# Altium schematic sheet sixuanyi.SchDoc
size A2
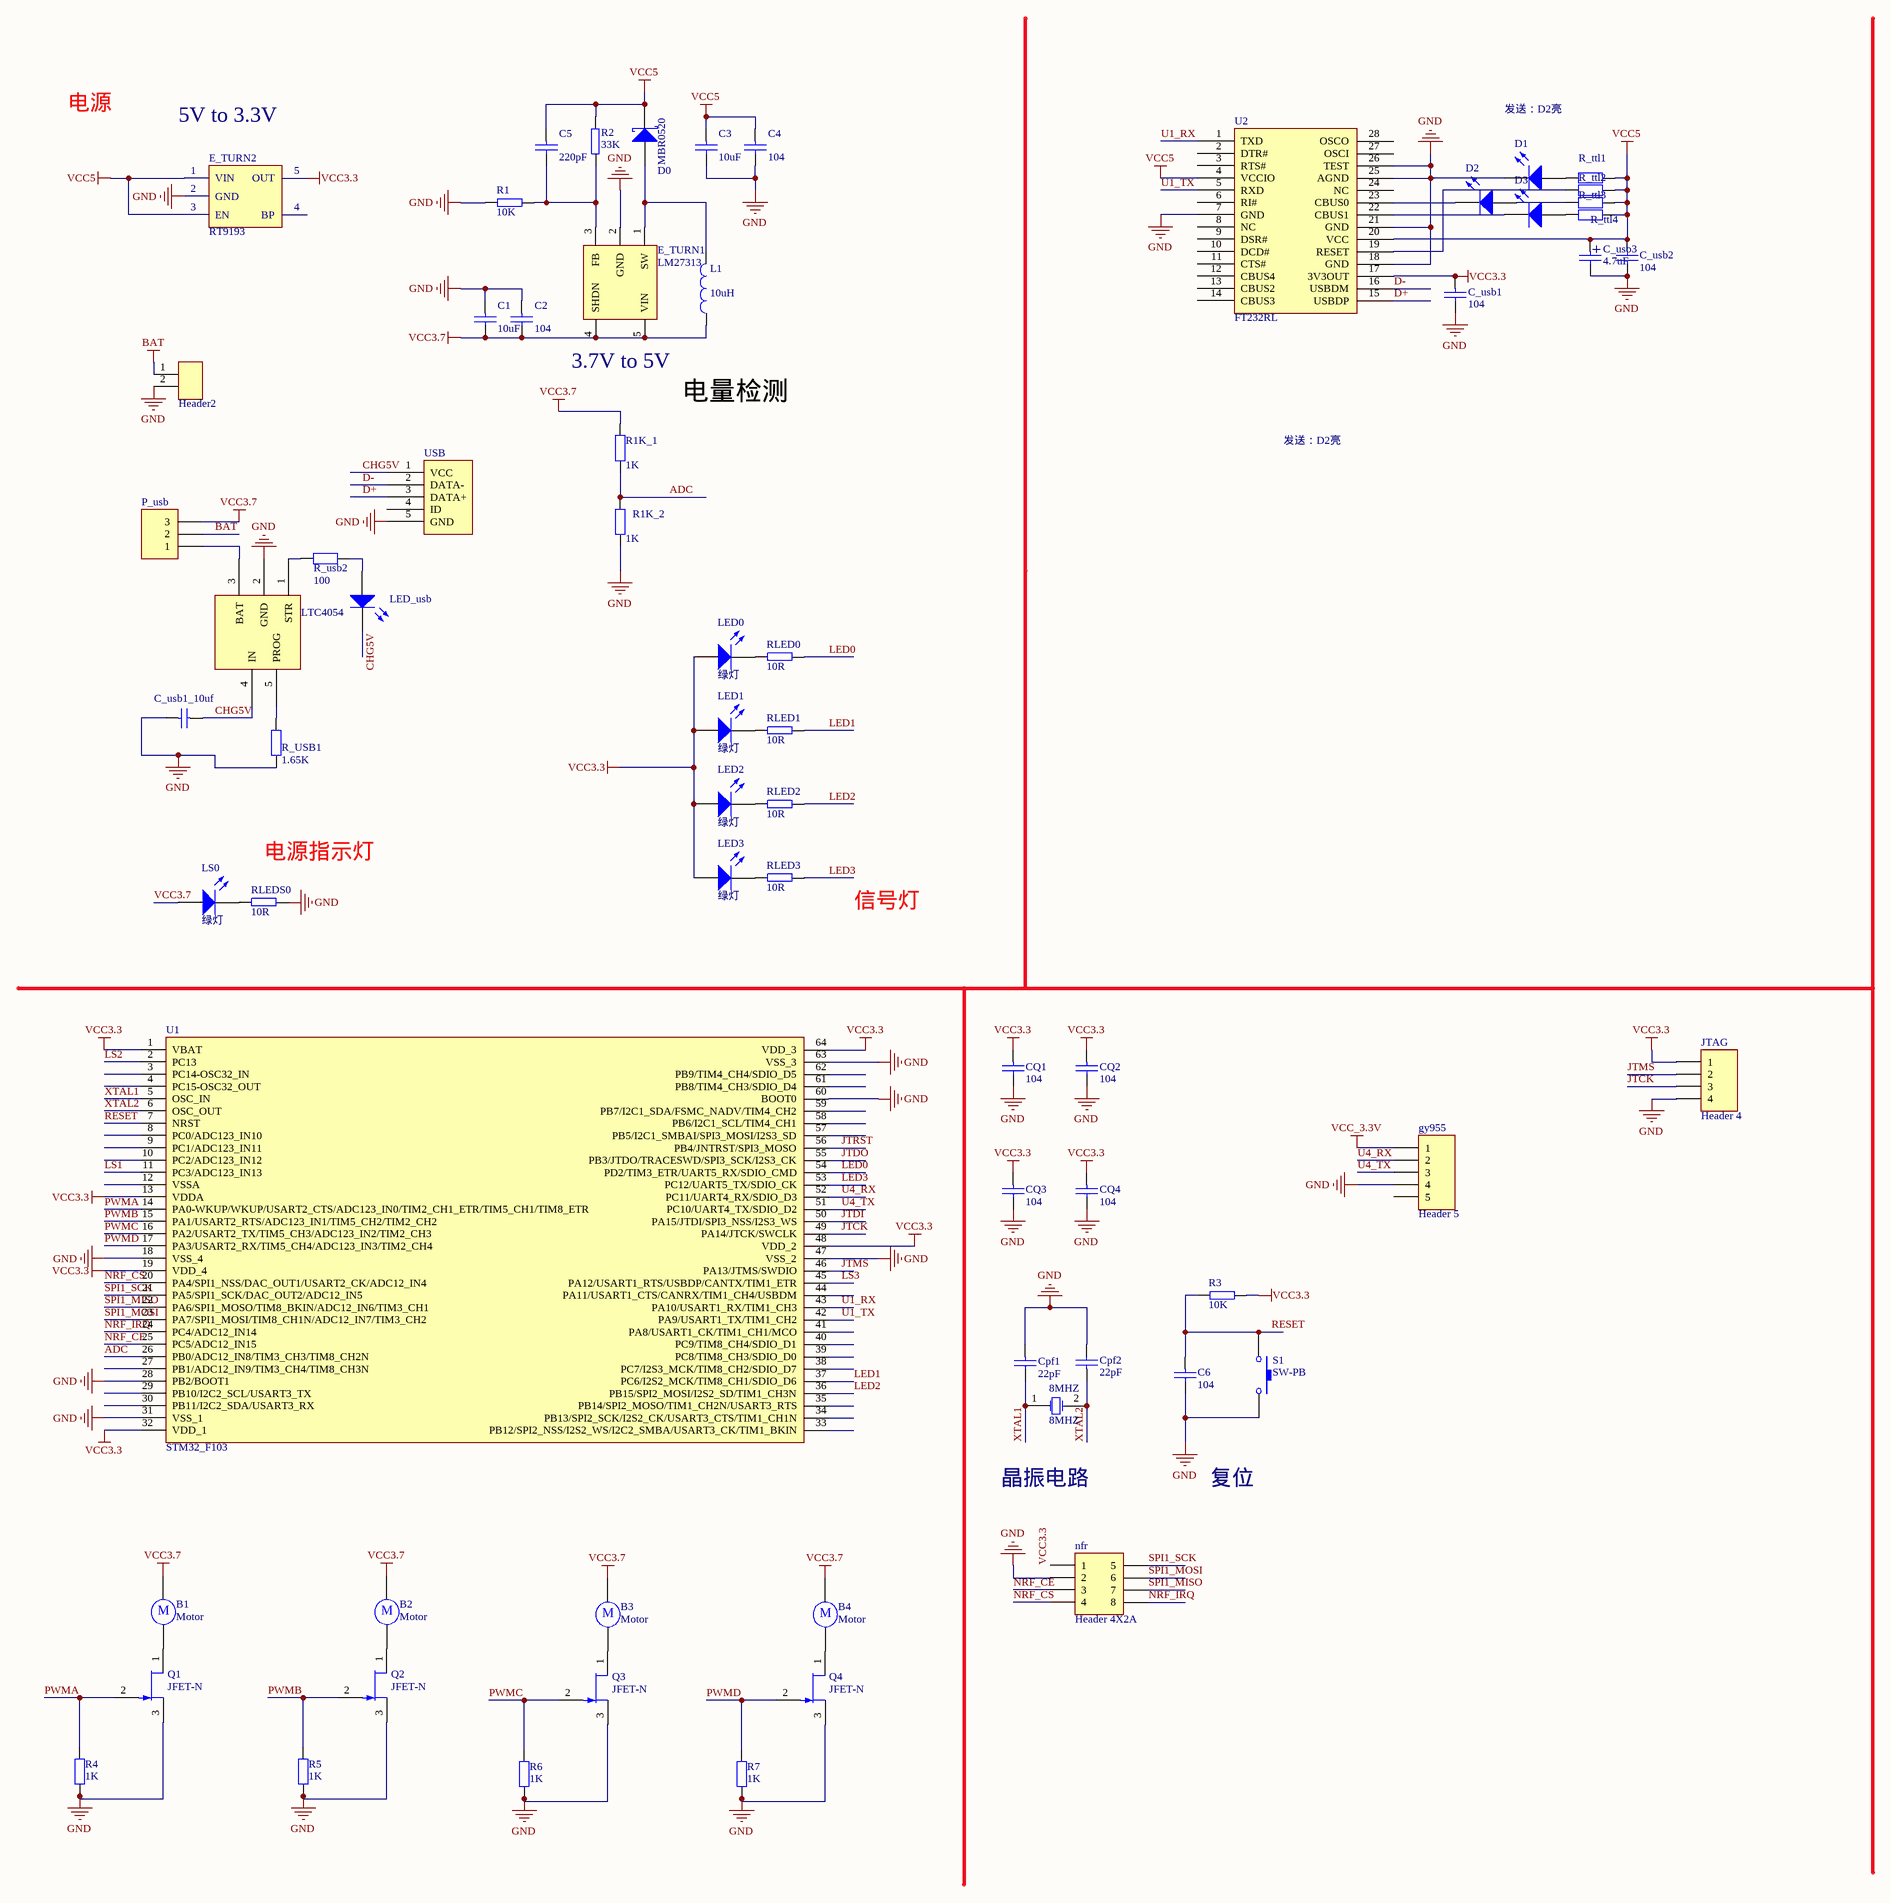
[diagram p0: sixuanyi.SchDoc]

## Parts
8MHZ  8MHZ  [XTAL_D]
B1  Motor  [RB5-10.5]
B2  Motor  [RB5-10.5]
B3  Motor  [RB5-10.5]
B4  Motor  [RB5-10.5]
C1  10uF  [0603p]
C2  104  [0603p]
C3  10uF  [0603_WYN]
C4  104  [0603_WYN]
C5  220pF  [0603_WYN]
C6  104  [0603_WYN]
C_usb1  104  [0603P]
C_usb1_10uf  C_usb1_10uf  [0603p]  (value not drawn)
C_usb2  104  [0603P]
C_usb3  4.7uF  [1206]
Cpf1  22pF  [0603_WYN]
Cpf2  22pF  [0603_WYN]
CQ1  104  [0603_WYN]
CQ2  104  [0603_WYN]
CQ3  104  [0603_WYN]
CQ4  104  [0603_WYN]
D0  MBR0520  [SMB]
D1  LED2  [SMDLED]  (value not drawn)
D2  LED2  [SMDLED]  (value not drawn)
D3  LED2  [SMDLED]  (value not drawn)
E_TURN1  LM27313  [SOT23-6]
E_TURN2  RT9193  [SOT23-6]
gy955  Header 5  [HDR1X5]
JTAG  Header 4  [HDR1X4]
L1  value 10uH  [0805_WYN]  (hidden comment: Inductor)
LED0  绿灯  [0603_WYN]
LED1  绿灯  [0603_WYN]
LED2  绿灯  [0603_WYN]
LED3  绿灯  [0603_WYN]
LED_usb  黄灯  [极性0805_WYN]  (value not drawn)
LS0  绿灯  [0603_WYN]
LTC4054  LTC4054  [SOT23-6]
nfr  Header 4X2A  [24L01-L]
P_usb  P_usb  [HDR1X3]  (value not drawn)
power  Header2  [HDR1X2]
Q1  JFET-N  [SI2302]
Q2  JFET-N  [SI2302]
Q3  JFET-N  [SI2302]
Q4  JFET-N  [SI2302]
R1  10K  [0603_WYN]
R1K_1  value 1K  [AXIAL-0.4]  (hidden comment: Res2)
R1K_2  value 1K  [AXIAL-0.4]  (hidden comment: Res2)
R2  33K  [0603_WYN]
R3  10K  [0603_WYN]
R4  value 1K  [AXIAL-0.4]  (hidden comment: Res2)
R5  value 1K  [AXIAL-0.4]  (hidden comment: Res2)
R6  value 1K  [AXIAL-0.4]  (hidden comment: Res2)
R7  value 1K  [AXIAL-0.4]  (hidden comment: Res2)
R_ttl1  1K  [0603p]  (value not drawn)
R_ttl2  1K  [0603p]  (value not drawn)
R_ttl3  1K  [0603p]  (value not drawn)
R_ttl4  1K  [0603p]  (value not drawn)
R_USB1  R_USB1  value 1.65K  [0603p]
R_usb2  R_usb2  value 100  [0603p]
RLED0  10R  [0603_WYN]
RLED1  10R  [0603_WYN]
RLED2  10R  [0603_WYN]
RLED3  10R  [0603_WYN]
RLEDS0  10R  [0603_WYN]
S1  SW-PB  [CLICK]
U1  STM32_F103  [LQFP64]
U2  FT232RL  [SSOP-28]
USB  usb mini  [USB - duplicate1]  (value not drawn)

## Nets
BAT: P_usb.2 power.1
GND: C1.1 C2.1 C3.2 C4.2 C6.2 C_usb1.2 C_usb1_10uf.2 C_usb2.2 C_usb3.2 Cpf1.1 Cpf2.2 CQ1.2 CQ2.2 CQ3.2 CQ4.2 D1.2(K) E_TURN1.2(GND) E_TURN2.2(GND) gy955.4 JTAG.4 LTC4054.2(GND) nfr.2 power.2 Q1.3(S) Q2.3(S) Q3.3(S) Q4.3(S) R1.1 R1K_2.1 R4.1 R5.1 R6.1 R7.1 R_USB1.1 RLEDS0.1 S1.2 U1.18(VSS_4) U1.28(PB2/BOOT1) U1.31(VSS_1) U1.47(VSS_2) U1.60(BOOT0) U1.63(VSS_3) U2.7(GND) U2.18(GND) U2.21(GND) U2.25(AGND) U2.26(TEST) USB.5(GND)
VCC3.3: C_usb1.1 CQ1.1 CQ2.1 CQ3.1 CQ4.1 E_TURN2.5(OUT) JTAG.1 LED0.1(A) LED1.1(A) LED2.1(A) LED3.1(A) nfr.1 R3.2 U1.1(VBAT) U1.13(VDDA) U1.19(VDD_4) U1.32(VDD_1) U1.48(VDD_2) U1.64(VDD_3) U2.17(3V3OUT)
VCC3.7: B1.1 B2.1 B3.1 B4.1 C1.2 C2.2 E_TURN1.4(SHDN) E_TURN1.5(VIN) L1.1 LS0.1(A) P_usb.3 R1K_1.2
VCC5: C3.1 C4.1 C5.1 C_usb2.1 C_usb3.1 D0.2(K) E_TURN2.1(VIN) E_TURN2.3(EN) R2.2 R_ttl1.2 R_ttl2.2 R_ttl3.2 R_ttl4.2 U2.4(VCCIO) U2.20(VCC)
VCC_3.3V: gy955.1
ADC: R1K_1.1 R1K_2.2 U1.26(PB0/ADC12_IN8/TIM3_CH3/TIM8_CH2N)
CHG5V: C_usb1_10uf.1 LED_usb.2(K) LTC4054.4(IN) USB.1(VCC)
D+: U2.15(USBDP) USB.3(DATA+)
D-: U2.16(USBDM) USB.2(DATA-)
JTCK: JTAG.3 U1.49(PA14/JTCK/SWCLK)
JTDI: U1.50(PA15/JTDI/SPI3_NSS/I2S3_WS)
JTDO: U1.55(PB3/JTDO/TRACESWD/SPI3_SCK/I2S3_CK)
JTMS: JTAG.2 U1.46(PA13/JTMS/SWDIO)
JTRST: U1.56(PB4/JNTRST/SPI3_MOSO)
LED0: RLED0.1 U1.54(PD2/TIM3_ETR/UART5_RX/SDIO_CMD)
LED1: RLED1.1 U1.37(PC6/I2S2_MCK/TIM8_CH1/SDIO_D6)
LED2: RLED2.1 U1.36(PB15/SPI2_MOSI/I2S2_SD/TIM1_CH3N)
LED3: RLED3.1 U1.53(PC12/UART5_TX/SDIO_CK)
LS1: U1.11(PC3/ADC123_IN13)
LS2: U1.2(PC13)
LS3: U1.45(PA12/USART1_RTS/USBDP/CANTX/TIM1_ETR)
NRF_CE: nfr.3 U1.25(PC5/ADC12_IN15)
NRF_CS: nfr.4 U1.20(PA4/SPI1_NSS/DAC_OUT1/USART2_CK/ADC12_IN4)
NRF_IRQ: nfr.8 U1.24(PC4/ADC12_IN14)
PWMA: Q1.2(G) R4.2 U1.14(PA0-WKUP/WKUP/USART2_CTS/ADC123_IN0/TIM2_CH1_ETR/TIM5_CH1/TIM8_ETR)
PWMB: Q2.2(G) R5.2 U1.15(PA1/USART2_RTS/ADC123_IN1/TIM5_CH2/TIM2_CH2)
PWMC: Q3.2(G) R6.2 U1.16(PA2/USART2_TX/TIM5_CH3/ADC123_IN2/TIM2_CH3)
PWMD: Q4.2(G) R7.2 U1.17(PA3/USART2_RX/TIM5_CH4/ADC123_IN3/TIM2_CH4)
RESET: C6.1 R3.1 S1.1 U1.7(NRST)
SPI1_MISO: nfr.7 U1.22(PA6/SPI1_MOSO/TIM8_BKIN/ADC12_IN6/TIM3_CH1)
SPI1_MOSI: nfr.6 U1.23(PA7/SPI1_MOSI/TIM8_CH1N/ADC12_IN7/TIM3_CH2)
SPI1_SCK: nfr.5 U1.21(PA5/SPI1_SCK/DAC_OUT2/ADC12_IN5)
U1_RX: U1.43(PA10/USART1_RX/TIM1_CH3) U2.1(TXD)
U1_TX: U1.42(PA9/USART1_TX/TIM1_CH2) U2.5(RXD)
U4_RX: gy955.2 U1.52(PC11/UART4_RX/SDIO_D3)
U4_TX: gy955.3 U1.51(PC10/UART4_TX/SDIO_D2)
XTAL1: 8MHZ.1(OSC1) Cpf1.2 U1.5(OSC_IN)
XTAL2: 8MHZ.2(OSC2) Cpf2.1 U1.6(OSC_OUT)
NetB1_2: B1.2 Q1.1(D)
NetB2_2: B2.2 Q2.1(D)
NetB3_2: B3.2 Q3.1(D)
NetB4_2: B4.2 Q4.1(D)
NetC5_2: C5.2 E_TURN1.3(FB) R1.2 R2.1
NetD0_1: D0.1(A) E_TURN1.1(SW) L1.2
NetD1_1: D1.1(A) R_ttl1.1
NetD2_1: D2.1(A) R_ttl3.1
NetD2_2: D2.2(K) U2.23(CBUS0)
NetD3_1: D3.1(A) R_ttl4.1
NetD3_2: D3.2(K) U2.22(CBUS1)
NetLED0_2: LED0.2(K) RLED0.2
NetLED1_2: LED1.2(K) RLED1.2
NetLED2_2: LED2.2(K) RLED2.2
NetLED3_2: LED3.2(K) RLED3.2
NetLED_usb_1: LED_usb.1(A) R_usb2.2
NetLS0_2: LS0.2(K) RLEDS0.2
NetLTC4054_1: LTC4054.1(STR) R_usb2.1
NetLTC4054_3: LTC4054.3(BAT) P_usb.1
NetLTC4054_5: LTC4054.5(PROG) R_USB1.2
NetR_ttl2_1: R_ttl2.1 U2.19(RESET)

Not connected (* = marked no-connect by the designer): E_TURN2 4(BP); gy955 5; U1 3(PC14-OSC32_IN) 4(PC15-OSC32_OUT) 8(PC0/ADC123_IN10) 9(PC1/ADC123_IN11) 10(PC2/ADC123_IN12) 12(VSSA) 27(PB1/ADC12_IN9/TIM3_CH4/TIM8_CH3N) 29(PB10/I2C2_SCL/USART3_TX) 30(PB11/I2C2_SDA/USART3_RX) 33(PB12/SPI2_NSS/I2S2_WS/I2C2_SMBA/USART3_CK/TIM1_BKIN) 34(PB13/SPI2_SCK/I2S2_CK/USART3_CTS/TIM1_CH1N) 35(PB14/SPI2_MOSO/TIM1_CH2N/USART3_RTS) 38(PC7/I2S3_MCK/TIM8_CH2/SDIO_D7) 39(PC8/TIM8_CH3/SDIO_D0) 40(PC9/TIM8_CH4/SDIO_D1) 41(PA8/USART1_CK/TIM1_CH1/MCO) 44(PA11/USART1_CTS/CANRX/TIM1_CH4/USBDM) 57(PB5/I2C1_SMBAI/SPI3_MOSI/I2S3_SD) 58(PB6/I2C1_SCL/TIM4_CH1) 59(PB7/I2C1_SDA/FSMC_NADV/TIM4_CH2) 61(PB8/TIM4_CH3/SDIO_D4) 62(PB9/TIM4_CH4/SDIO_D5); U2 2(DTR#) 3(RTS#) 6(RI#) 8(NC) 9(DSR#) 10(DCD#) 11(CTS#) 12(CBUS4) 13(CBUS2) 14(CBUS3) 24(NC) 27(OSCI) 28(OSCO); USB 4(ID)

## Notes on the sheet
- 电源
- 5V to 3.3V
- 发送：D2亮
- 3.7V to 5V
- 电量检测
- (near RLEDS0) 电源指示灯
- 信号灯
- 晶振电路
- 复位
- (in symbol Motor) M

## Library data of the parts
8MHZ = XTAL: Crystal Oscillator; Published: 8-Jun-2000; LatestRevisionDate: 17-Jul-2002; LatestRevisionNote: Re-released for DXP Platform.; Publisher: Altium Limited
B1-B4 = Motor: Motor, General Kind; Published: 24-Mar-1999; LatestRevisionDate: 17-Jul-2002; LatestRevisionNote: Re-released for DXP Platform.; PackageReference: RB5-10.5; Publisher: Altium Limited; PackageDescription: Capacitor (Radial); 2 Leads
C1-C6 C_usb1 C_usb2 Cpf1 Cpf2 CQ1-CQ4 = CAP_WYN
C_usb1_10uf = Cap: Capacitor; Value: 0.1uF; Published: 8-Jun-2000; LatestRevisionDate: 17-Jul-2002; LatestRevisionNote: Re-released for DXP Platform.; PackageReference: RAD-0.3; Publisher: Altium Limited; PackageDescription: Radial Cap, Thru-Hole; 2 Leads; 0.3 in Pin Spacing
C_usb3 = CAP_POL_WYN
D0 = D Schottky: Schottky Diode; Published: 8-Jun-2000; LatestRevisionDate: 17-Jul-2002; LatestRevisionNote: Re-released for DXP Platform.; PackageReference: SMB; Publisher: Altium Limited; PackageDescription: DO-214-AA/SMB; 2 C-Bend Leads; Body 5.3 x 3.6 mm, inc. leads (LxW); Code_JEDEC: DO-214-AA
D1-D3 = LED2: Typical RED, GREEN, YELLOW, AMBER GaAs LED; Published: 8-Jun-2000; LatestRevisionDate: 17-Jul-2002; LatestRevisionNote: Re-released for DXP Platform.; PackageVersion: Feb-2002; PackageReference: 3.2X1.6X1.1; Publisher: Altium Limited; PackageDescription: SM LED; 2 Flat Leads
gy955 = Header 5: Header, 5-Pin; LatestRevisionDate: 17-Jul-2002; LatestRevisionNote: Re-released for DXP Platform.; Publisher: Altium Limited
JTAG = Header 4: Header, 4-Pin; LatestRevisionDate: 17-Jul-2002; LatestRevisionNote: Re-released for DXP Platform.; Publisher: Altium Limited
L1 = Inductor: Code_IEC: 1005; Published: 8-Jun-2000; LatestRevisionDate: 29-May-2009; LatestRevisionNote: IPC-7351 Footprint Added.; PackageReference: 0402-A; Publisher: Altium Limited; PackageDescription: Chip Inductor; Code_JEITA: 0402
LED0-LED3 LS0 = LED_WYN: Typical RED, GREEN, YELLOW, AMBER GaAs LED; Published: 8-Jun-2000; LatestRevisionDate: 17-Jul-2002; LatestRevisionNote: Re-released for DXP Platform.; PackageDocument: Feb-2002; PackageReference: 3.2X1.6X1.1; Publisher: Altium Limited
LED_usb = LED1: Typical RED GaAs LED; Published: 8-Jun-2000; LatestRevisionDate: 08-Jul-2005; LatestRevisionNote: Mech Layer 1 removed.; PackageReference: LED-1; Publisher: Altium Limited
nfr = Header 4X2A: Header, 4-Pin, Dual row; LatestRevisionDate: 17-Jul-2002; LatestRevisionNote: Re-released for DXP Platform.; Publisher: Altium Limited
P_usb = Header 3: Header, 3-Pin; LatestRevisionDate: 17-Jul-2002; LatestRevisionNote: Re-released for DXP Platform.; Publisher: Altium Limited
Q1-Q4 = JFET-N: N-Channel JFET; Published: 8-Jun-2000; LatestRevisionDate: 17-Jul-2002; LatestRevisionNote: Re-released for DXP Platform.; PackageReference: TO-254-AA; Publisher: Altium Limited; Code_JEDEC: TO-254-AA
R1-R3 RLED0-RLED3 RLEDS0 = RES_WYN
R1K_1 R1K_2 R4-R7 R_USB1 R_usb2 = Res2: Resistor; Published: 8-Jun-2000; LatestRevisionDate: 17-Jul-2002; LatestRevisionNote: Re-released for DXP Platform.; PackageReference: AXIAL-0.4; Publisher: Altium Limited; PackageDescription: Axial Device, Thru-Hole; 2 Leads; 0.4 in Pin Spacing
R_ttl1-R_ttl4 = Res2: Resistor; Value: 4.7k; Published: 8-Jun-2000; LatestRevisionDate: 17-Jul-2002; LatestRevisionNote: Re-released for DXP Platform.; PackageReference: AXIAL-0.4; Publisher: Altium Limited
S1 = SW-PB: Switch; Published: 24-Mar-1999; LatestRevisionDate: 17-Jul-2002; LatestRevisionNote: Re-released for DXP Platform.; PackageReference: SPST-2; Publisher: Altium Limited; PackageDescription: Switch; 2 Leads